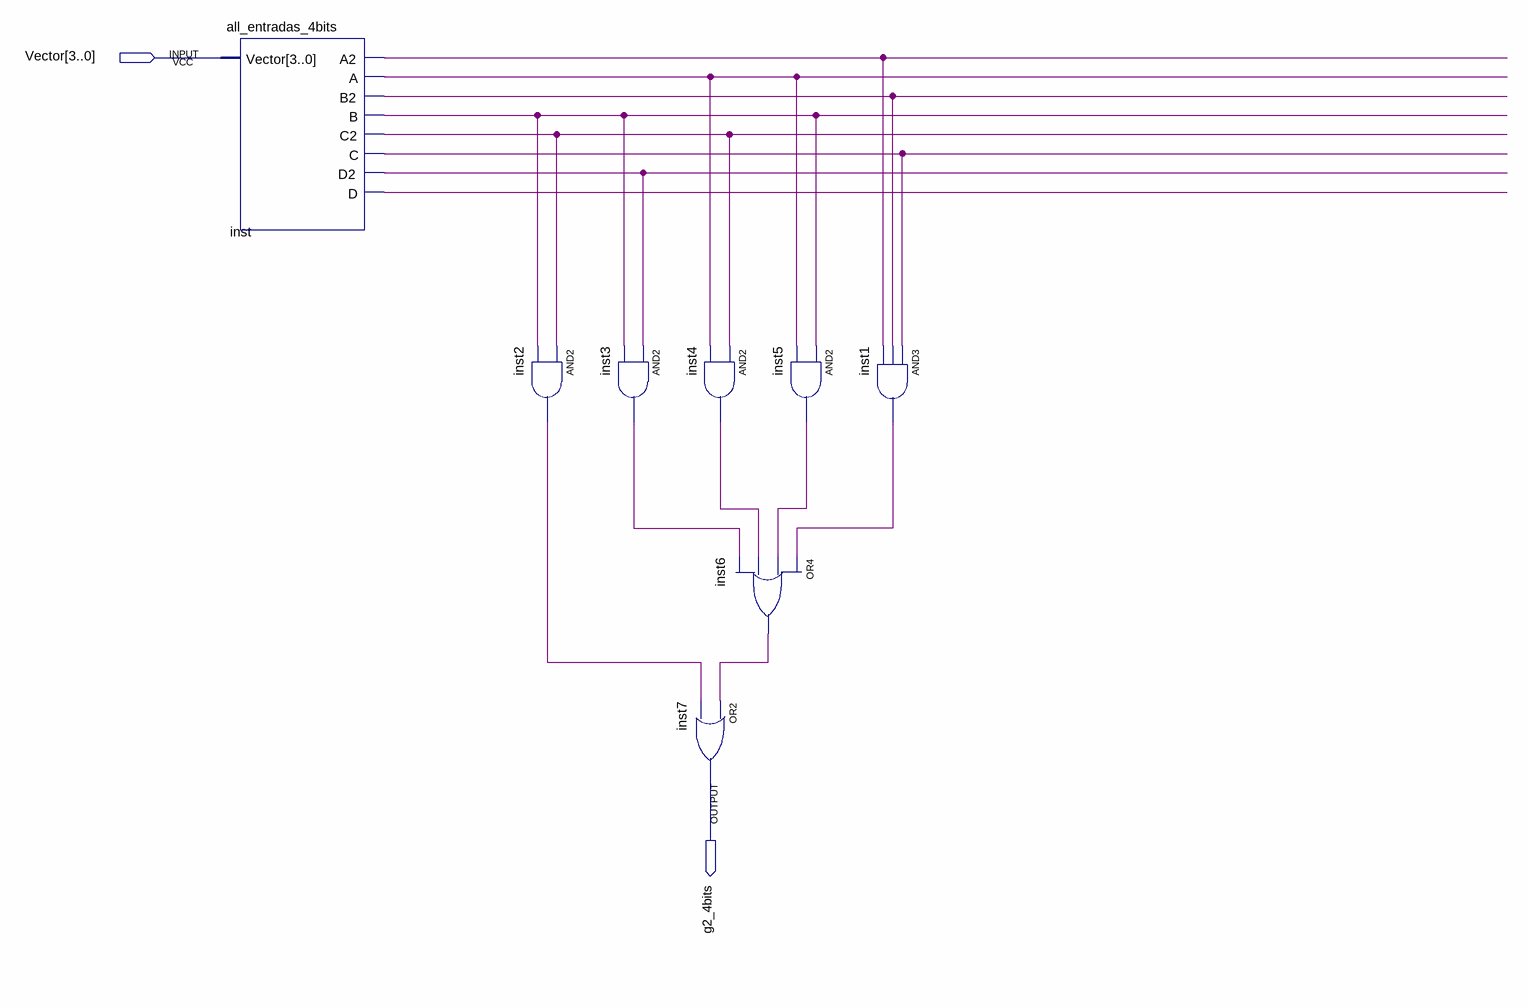
[diagram p0: schematic sheet]
// Quartus schematic g2_4bits.bdf as structural Verilog: 8 symbols, 2 pins
module g2_4bits (
  input  [3:0] Vector,
  output g2_4bits
);

  wire inst1_out, inst2_out, inst3_out, inst4_out, inst5_out, inst6_out, inst_a, inst_a2, inst_b, inst_b2,
       inst_c, inst_c2, inst_d, inst_d2;

  all_entradas_4bits inst (
    .Vector(Vector), .A2(inst_a2), .A(inst_a), .B2(inst_b2), .B(inst_b), .C2(inst_c2), .C(inst_c),
    .D2(inst_d2), .D(inst_d));
  and inst2 (inst2_out, inst_c2, inst_b);
  and inst3 (inst3_out, inst_d2, inst_b);
  and inst4 (inst4_out, inst_c2, inst_a);
  or inst6 (inst6_out, inst1_out, inst5_out, inst4_out, inst3_out);
  or inst7 (g2_4bits, inst6_out, inst2_out);
  and inst5 (inst5_out, inst_b, inst_a);
  and inst1 (inst1_out, inst_c, inst_b2, inst_a2);
endmodule
